# Altium schematic sheet Touch_sensors.SchDoc
size A4; SheetNumber: 4; SheetTotal: 4
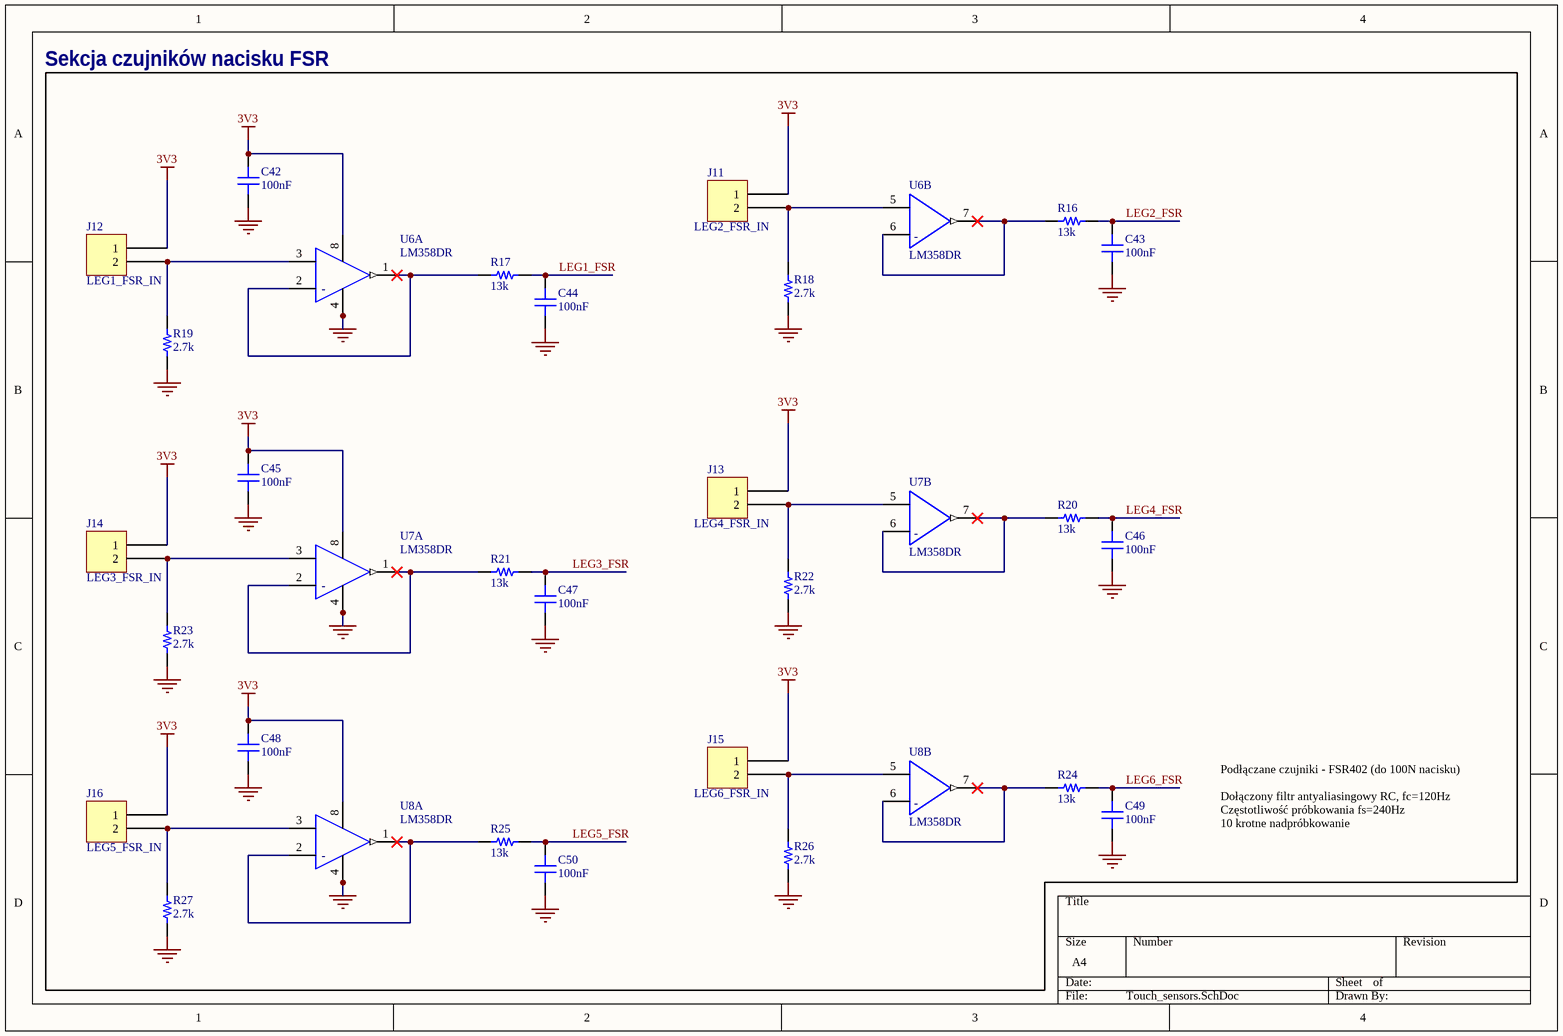
[diagram p0: Touch_sensors.SchDoc]

## Parts
C42  Capacitance: 100nF  [CAP 0603_1608]  (hidden comment: 0.1 µF)
C43  Capacitance: 100nF  [CAP 0603_1608]  (hidden comment: 0.1 µF)
C44  Capacitance: 100nF  [CAP 0603_1608]  (hidden comment: 0.1 µF)
C45  Capacitance: 100nF  [CAP 0603_1608]  (hidden comment: 0.1 µF)
C46  Capacitance: 100nF  [CAP 0603_1608]  (hidden comment: 0.1 µF)
C47  Capacitance: 100nF  [CAP 0603_1608]  (hidden comment: 0.1 µF)
C48  Capacitance: 100nF  [CAP 0603_1608]  (hidden comment: 0.1 µF)
C49  Capacitance: 100nF  [CAP 0603_1608]  (hidden comment: 0.1 µF)
C50  Capacitance: 100nF  [CAP 0603_1608]  (hidden comment: 0.1 µF)
J11  LEG2_FSR_IN  [JST XH B2B-XH-A]
J12  LEG1_FSR_IN  [JST XH B2B-XH-A]
J13  LEG4_FSR_IN  [JST XH B2B-XH-A]
J14  LEG3_FSR_IN  [JST XH B2B-XH-A]
J15  LEG6_FSR_IN  [JST XH B2B-XH-A]
J16  LEG5_FSR_IN  [JST XH B2B-XH-A]
R16  13k  [RES 0603_1608]
R17  13k  [RES 0603_1608]
R18  2.7k  [YAGEO RES 0603_1608]
R19  2.7k  [YAGEO RES 0603_1608]
R20  13k  [RES 0603_1608]
R21  13k  [RES 0603_1608]
R22  2.7k  [YAGEO RES 0603_1608]
R23  2.7k  [YAGEO RES 0603_1608]
R24  13k  [RES 0603_1608]
R25  13k  [RES 0603_1608]
R26  2.7k  [YAGEO RES 0603_1608]
R27  2.7k  [YAGEO RES 0603_1608]
U6  LM358DR  [FP-D0008A-MFG]  (parts A,B of 2)
U7  LM358DR  [FP-D0008A-MFG]  (parts A,B of 2)
U8  LM358DR  [FP-D0008A-MFG]  (parts A,B of 2)

## Nets
3V3: C42.2 C45.2 C48.2 J11.1 J12.1 J13.1 J14.1 J15.1 J16.1 U6.8(V+) U7.8(V+) U8.8(V+)
GND: C42.1 C43.1 C44.1 C45.1 C46.1 C47.1 C48.1 C49.1 C50.1 R18.1 R19.1 R22.1 R23.1 R26.1 R27.1 U6.4(V-) U7.4(V-) U8.4(V-)
LEG1_FSR: C44.2 R17.2
LEG2_FSR: C43.2 R16.2
LEG3_FSR: C47.2 R21.2
LEG4_FSR: C46.2 R20.2
LEG5_FSR: C50.2 R25.2
LEG6_FSR: C49.2 R24.2
NetJ11_2: J11.2 R18.2 U6.5(IN2+)
NetJ12_2: J12.2 R19.2 U6.3(IN1+)
NetJ13_2: J13.2 R22.2 U7.5(IN2+)
NetJ14_2: J14.2 R23.2 U7.3(IN1+)
NetJ15_2: J15.2 R26.2 U8.5(IN2+)
NetJ16_2: J16.2 R27.2 U8.3(IN1+)
NetR16_1: R16.1 U6.6(IN2-) U6.7(2OUT)
NetR17_1: R17.1 U6.1(1OUT) U6.2(IN1-)
NetR20_1: R20.1 U7.6(IN2-) U7.7(2OUT)
NetR21_1: R21.1 U7.1(1OUT) U7.2(IN1-)
NetR24_1: R24.1 U8.6(IN2-) U8.7(2OUT)
NetR25_1: R25.1 U8.1(1OUT) U8.2(IN1-)

## Notes on the sheet
- Sekcja czujników nacisku FSR
- Podłączane czujniki - FSR402 (do 100N nacisku)
  Dołączony filtr antyaliasingowy RC, fc=120Hz
  Częstotliwość próbkowania fs=240Hz
  10 krotne nadpróbkowanie
- (in symbol CMP-1685-00009-2, part A) -
- (in symbol CMP-1685-00009-2, part B) -

## Library data of the parts
C42-C50 = CL10B104KA8NNNC: CAP CER 0.1UF 25V X7R 0603; manufacturer: Samsung Electro-Mechanics; Tolerance: ±10%; Part Number: CL10B104KA8NNNC; Applications: General Purpose; componentlink1description: Datasheet; componentlink1url: http://www.samsungsem.com/kr/support/product-search/mlcc/CL10B104KA8NNNC.jsp; componentlink2description: DigiKey Link; componentlink2url: https://www.digikey.com/en/products/detail/samsung-electro-mechanics/CL10B104KA8NNNC/3886664; Device Package: 0603 (1608 Metric); lastupdated: 09/02/2024 20:10:20; Lifecycle Status: Active; Minimum Order: 1; Mounting Type: Surface Mount, MLCC; Operating Temperature: -55°C ~ 125°C; Package / Case: 0603 (1608 Metric); packaging: TapeAndReel; partid: 9793; Part Status: Active; price: 0.01; series: CL; Size / Dimension: 0.063" L x 0.031" W (1.60mm x 0.80mm); Supplier 1: DigiKey; Supplier Part Number 1: 1276-1006-1-ND; Temperature Coefficient: X7R; Thickness (Max): 0.035" (0.90mm); value: 0.1 µF; Voltage - Rated: 25V
J11-J16 = B2B-XH-A(LF)(SN): CONN HEADER VERT 2POS 2.5MM; Manufacturer: JST Sales America Inc.; Contact Length - Post: 0.134" (3.40mm); Current Rating (Amps): 3A; Material Flammability Rating: UL94 V-0; Number of Positions: 2; Number of Positions Loaded: All; Pitch - Mating: 0.098" (2.50mm); Shrouding: Shrouded - 4 Wall; Style: Board to Cable/Wire; Voltage Rating: 250V; Part Number: B2B-XH-A(LF)(SN); ComponentLink1Description: Datasheet; ComponentLink1URL: http://www.jst-mfg.com/product/pdf/eng/eXH.pdf; ComponentLink2Description: DigiKey Link; ComponentLink2URL: http://digikey.com/product-detail/en/jst-sales-america-inc/B2B-XH-A-LF-SN/455-2247-ND/1651045; Connector Type: Header; Contact Finish - Mating: Tin; Contact Finish - Post: Tin; Contact Material: Brass; Contact Shape: Square; Contact Type: Male Pin; Fastening Type: Detent Lock; Insulation Color: Natural; Insulation Height: 0.276" (7.00mm); Insulation Material: Polyamide (PA66), Nylon 6/6; LastUpdated: 12/01/2020 23:46:08; Lifecycle Status: Active; Minimum Order: 1; Mounting Type: Through Hole; Number of Rows: 1; Operating Temperature: -25°C ~ 85°C; Packaging: Bulk; PartId: 67; Part Status: Active; Price: 0.15; Series: XH; Supplier 1: DigiKey; Supplier Part Number 1: 455-2247-ND; Termination: Press-Fit, Solder
R16 R17 R20 R21 R24 R25 = ERJ-3EKF1302V: RES SMD 13K OHM 1% 1/10W 0603; Manufacturer: Panasonic Electronic Components; Power (Watts): 0.1W, 1/10W; Resistance: 13 kOhms; Temperature Coefficient: ±100ppm/°C; Part Number: ERJ-3EKF1302V; Value: 13k; ComponentLink1Description: Datasheet; ComponentLink1URL: https://industrial.panasonic.com/cdbs/www-data/pdf/RDA0000/AOA0000C304.pdf; ComponentLink2Description: DigiKey Link; ComponentLink2URL: https://www.digikey.com/en/products/detail/panasonic-electronic-components/ERJ-3EKF1302V/196110; Composition: Thick Film; Device Package: 0603 (1608 Metric); Features: Automotive AEC-Q200; Height - Seated (Max): 0.022" (0.55mm); LastUpdated: 09/02/2024 20:42:14; Lifecycle Status: Active; Minimum Order: 1; Number of Terminations: 2; Operating Temperature: -55°C ~ 155°C; Package / Case: 0603 (1608 Metric); Packaging: TapeAndReel; PartId: 24117; Part Status: Active; Price: 0.01; Ratings: AEC-Q200; Series: ERJ-3EK; Size / Dimension: 0.063" L x 0.031" W (1.60mm x 0.80mm); Supplier 1: DigiKey; Supplier Part Number 1: P13.0KHCT-ND; Supplier Device Package: 0603; Tolerance: ±1%
R18 R19 R22 R23 R26 R27 = AC0603FR-072K7L: RES SMD 2.7K OHM 1% 1/10W 0603; Manufacturer: Yageo; Power (Watts): 0.1W, 1/10W; Resistance: 2.7 kOhms; Temperature Coefficient: ±100ppm/°C; Part Number: AC0603FR-072K7L; Value: 2.7k; ComponentLink1Description: Datasheet; ComponentLink1URL: https://www.yageo.com/upload/media/product/productsearch/datasheet/rchip/PYu-AC_51_RoHS_L_7.pdf; ComponentLink2Description: DigiKey Link; ComponentLink2URL: https://www.digikey.com/en/products/detail/yageo/AC0603FR-072K7L/5895994; Composition: Thick Film; Device Package: 0603 (1608 Metric); Features: Automotive AEC-Q200, Moisture Resistant; Height - Seated (Max): 0.022" (0.55mm); LastUpdated: 25/07/2024 09:19:23; Lifecycle Status: Active; Minimum Order: 1; Number of Terminations: 2; Operating Temperature: -55°C ~ 155°C; Package / Case: 0603 (1608 Metric); Packaging: CutTape; PartId: 17370; Part Status: Active; Price: 0.01; Ratings: AEC-Q200; Series: AC; Size / Dimension: 0.063" L x 0.031" W (1.60mm x 0.80mm); Supplier 1: DigiKey; Supplier Part Number 1: YAG3589CT-ND; Supplier Device Package: 0603; Tolerance: ±1%
U6-U8 = CMP-1685-00009-2: IC OPAMP GP 2 CIRCUIT 8SOIC; Output Current: 30mA; Min Dual Supply Voltage: 1.5V; Input Offset Voltage (Vos): 7mV; Power Supply Rejection Ratio (PSRR): 65dB; Unity Gain Bandwidth Product: 700kHz; Number of Channels: 2; Min Supply Voltage: 3V; Max Dual Supply Voltage: 16V; Dual Supply Voltage: 9V; Max Supply Voltage: 32V; Nominal Supply Current: 1.2mA; Slew Rate: 0.3V/µs; Input Bias Current: 250nA; Voltage Gain: 100dB; Operating Supply Current: 1mA; REACH SVHC: No SVHC; Package Quantity: 2500; Width: 3.91mm; Max Operating Temperature: 70°C; Min Operating Temperature: 0°C; Mount: Surface Mount; Length: 4.9mm; Radiation Hardening: No; Case/Package: SOIC; Lead Free: Lead Free; Number of Elements: 2; Packaging: Tape and Reel; Output Current per Channel: 30mA; Number of Circuits: 2; Bandwidth: 700kHz; Operating Supply Voltage: 16V; Gain Bandwidth Product: 700kHz; Number of Pins: 8; Number of Amplifiers: 2; Height: 1.58mm; Common Mode Rejection Ratio: 65dB; Contact Plating: Gold